# EasyEDA Pro project LEAP_ROS.epro, board PCB1
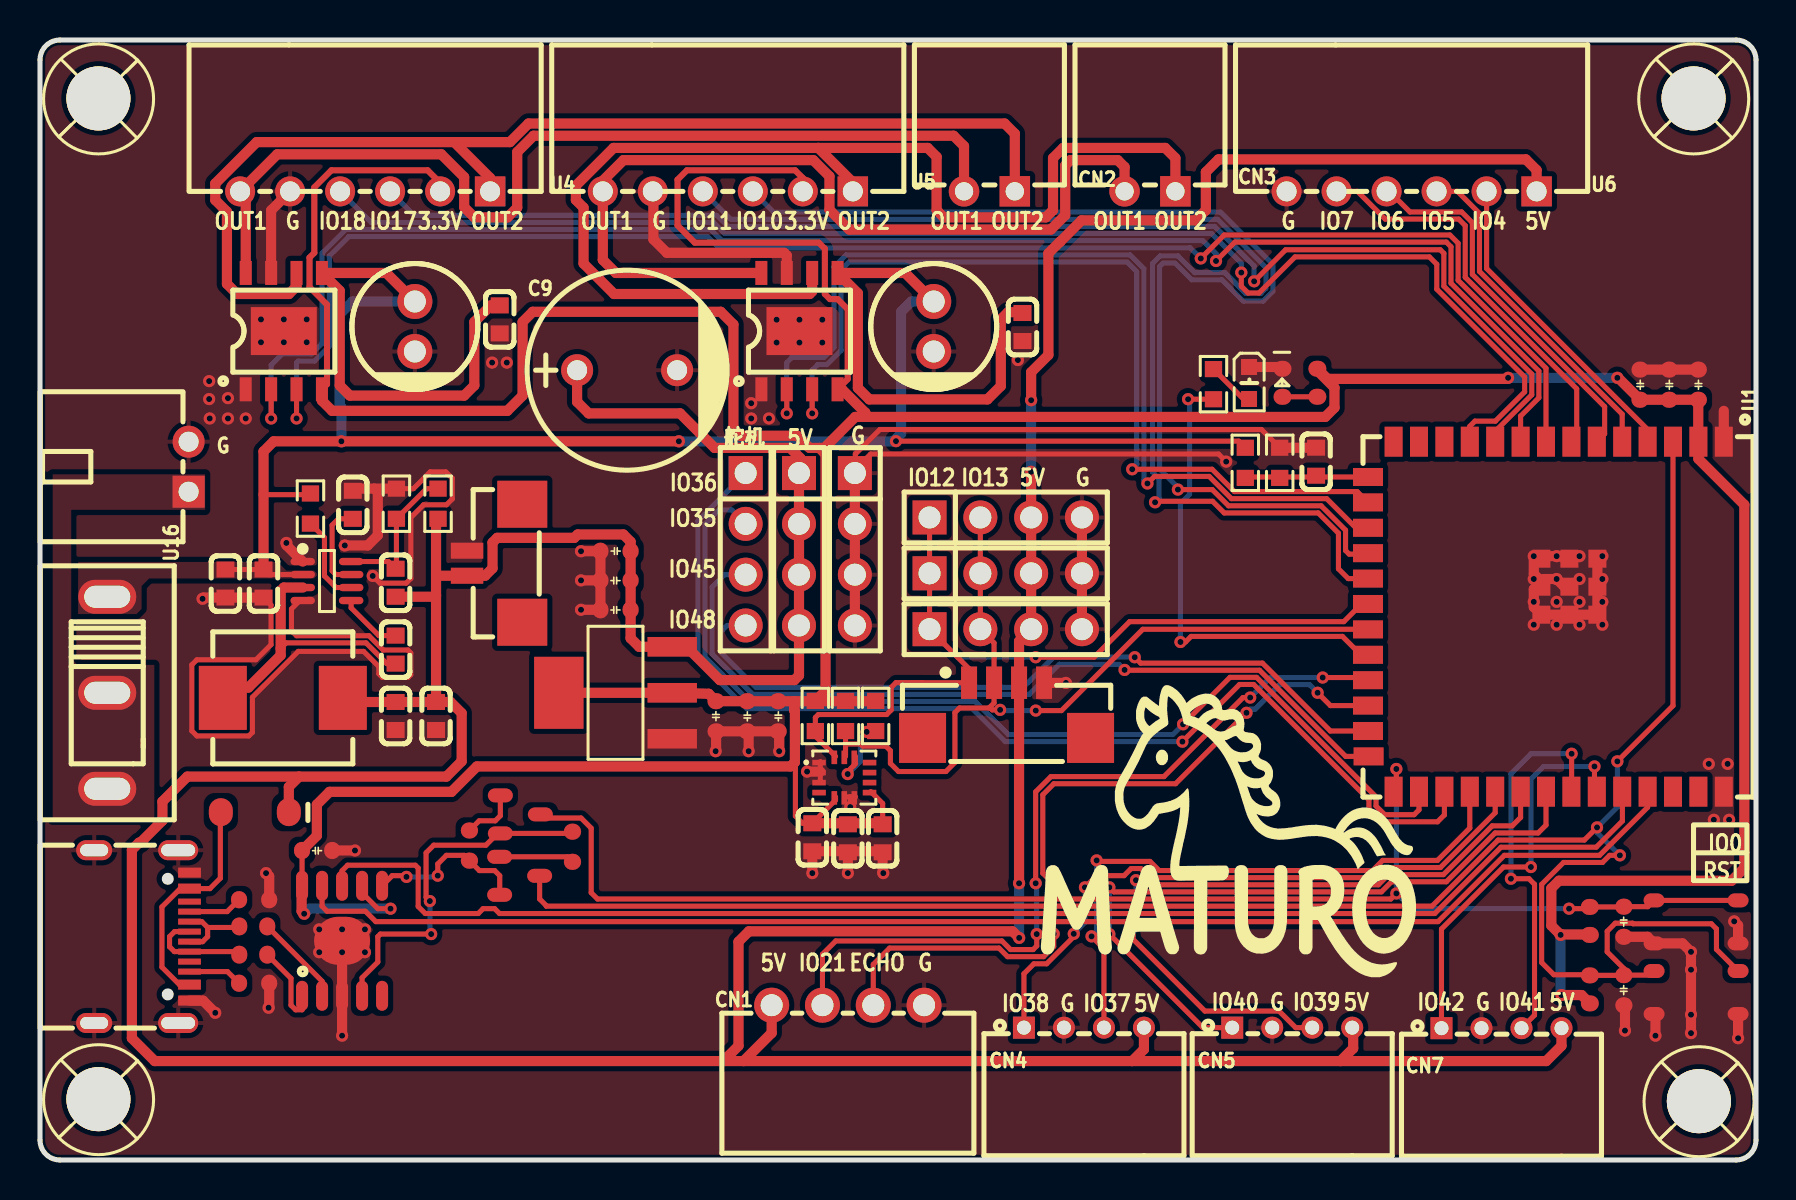
[diagram p2: board, top side]
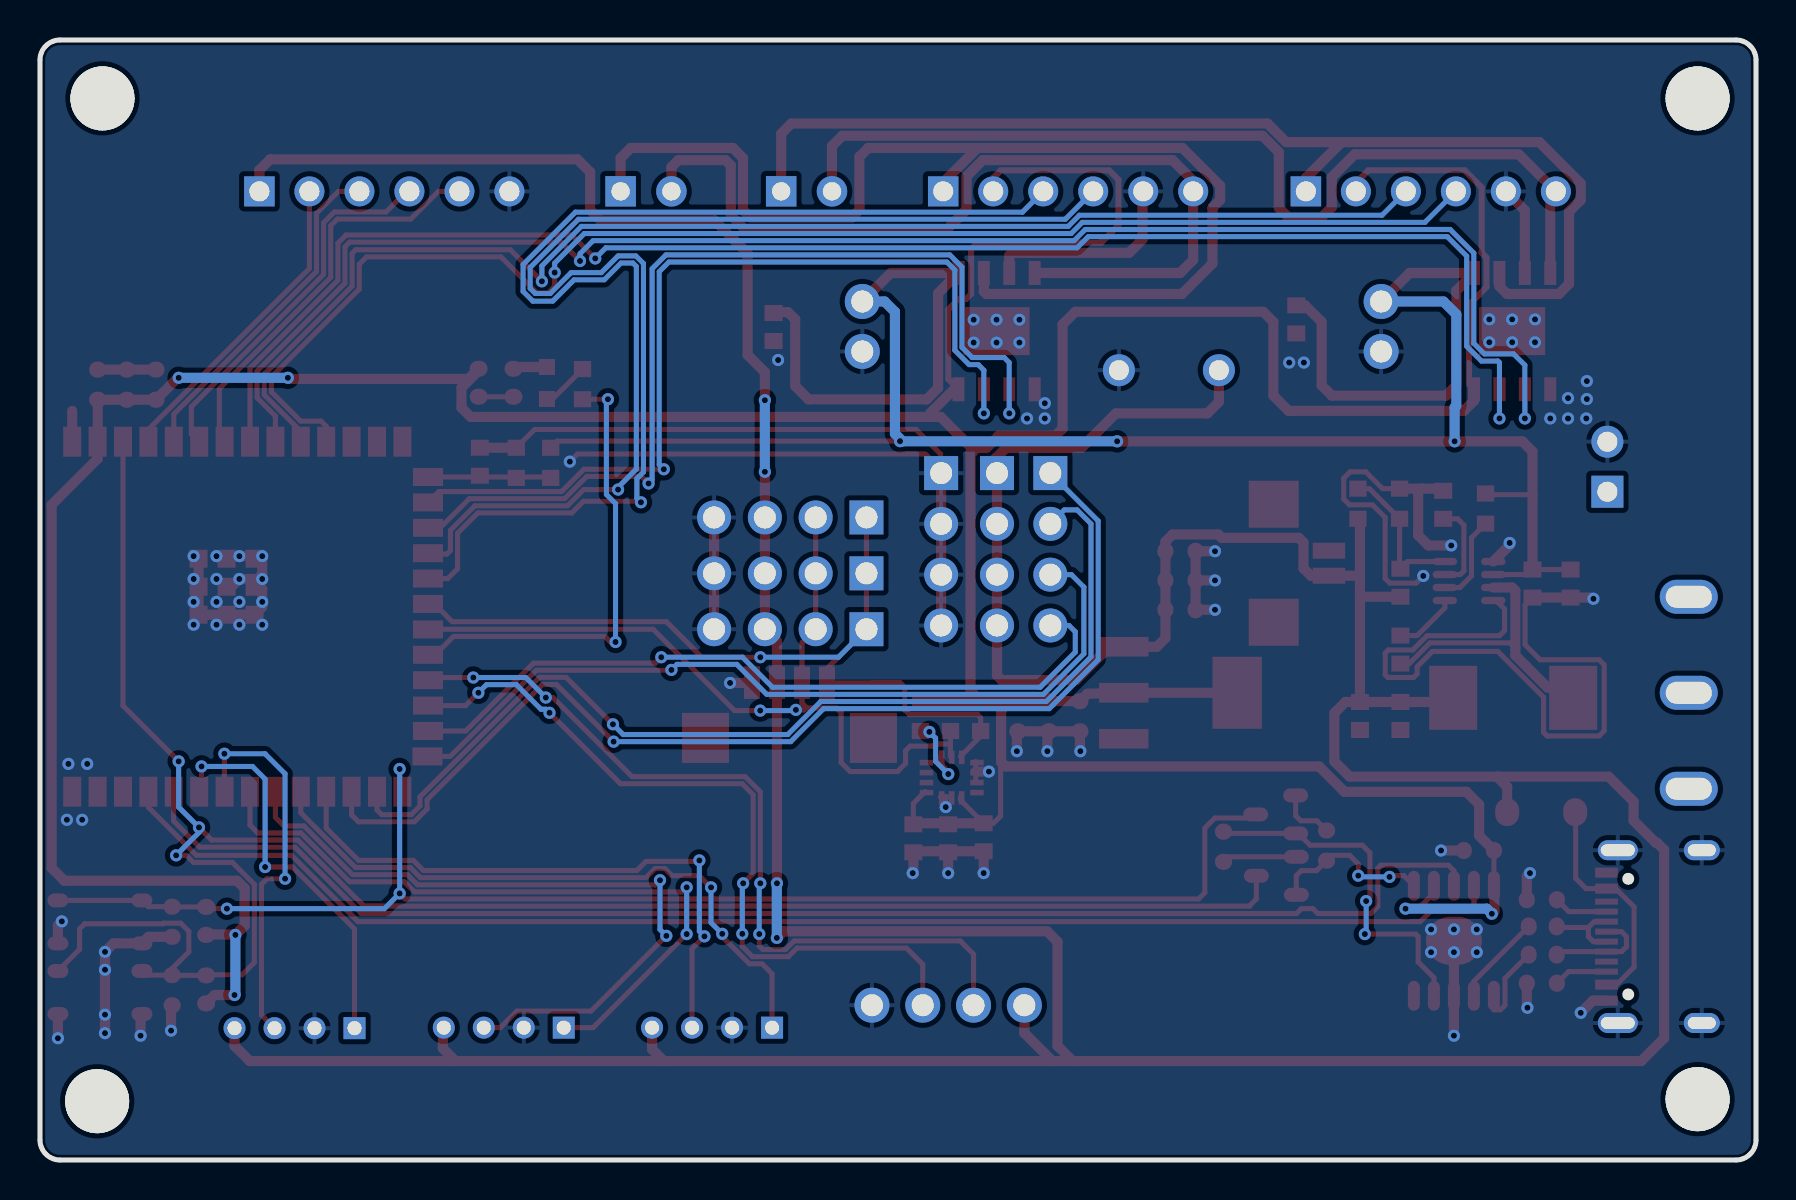
[diagram p3: board, bottom side, seen from below]

Outline 85.8 x 56 mm; copper layers: Top Layer, Bottom Layer. Coordinates in mm from the lower left corner of the outline.
Outline path: 0,55 0,1 arc(0.29,0.29) 1,0 84.8,0 arc(85.51,0.29) 85.8,1 85.8,55 arc(85.51,55.71) 84.8,56 1,56 arc(0.29,55.71) 0,55
Stack: Top Layer 0.035mm / Dielectric1 1.51mm FR4 er 4.5 / Bottom Layer 0.035mm

## Design rules (mm)
net GPIORX0: DP2
net GPIOTX0: DP2
net GPIO2: DP3
net GPIO1: DP3
net $2N57: DP1
net $2N56: DP1
spacing copperThickness1oz (default): track to track 0.102, other pairs 0.152 to 0.3
spacing copperThickness2oz: track to track 0.203, other pairs 0.152 to 0.3
spacing safeClearance1: track to track 0.152, other pairs 0 to 0.3
track width copperThickness1oz (default): min 0.127, default 0.254, max 2.54
track width copperThickness2oz: min 0.203, default 0.254, max 2.54
track width POWER: min 0.127, default 0.508, max 2.54
differential pair differentialPair (default): width min 0.127, default 0.254, max 2.54; gap min 0.152, default 0.152
net GND uses POWER, copperRegion
net 3V3 uses POWER
net 5V uses POWER

## Placement (name value [footprint] x y rotation side)
C1  100nF  [C0603#2]  38.62 16.14 90 top
C2  100nF  [C0603#2]  40.39 16.09 90 top
C3  10uF  [C0603#2]  42.13 16.09 90 top
C4  100nF  [C0603#2]  49.12 41.65 90 top
C5  220uF  [CAP-TH_BD6.3-P2.50-D0.6-FD-1]  18.74 41.67 270 top
C6  100nF  [C0603#2]  63.81 34.91 270 top
C7  220uF  [CAP-TH_BD6.3-P2.50-D0.6-FD-1]  44.69 41.67 270 top
C8  100nF  [C0603#2]  22.99 42.03 90 top
C9  2200uF  [CAP-TH_BD10.0-P5.00-D0.6-FD]  29.36 39.49 0 top
C14  10uF  [C0603#3]  36.92 22.18 90 top
C15  10uF  [C0603#3]  35.37 22.18 90 top
C16  100nF  [C0603]  33.8 22.2 90 top
C18  100nF  [C0603#2]  15.64 32.76 90 top
C19  22uF  [C0603#2]  11.18 28.82 90 top
C20  0.1uF  [C0603#2]  9.27 28.82 90 top
C21  33pF  [C0603#2]  17.78 28.86 270 top
C22  22uF  [C0603#2]  19.8 22.2 90 top
C23  22uF  [C0603#2]  17.78 22.2 90 top
C24  100nF  [C0603#2]  17.78 25.52 270 top
C25  10uF  [C0603#3]  28.77 28.96 0 top
C26  100nF  [C0603]  28.79 30.44 0 top
C27  100nF  [C0603#3]  79.18 11.92 270 top
C38  100nF  [C0603#3]  79.18 8.5 270 top
C41  100nF  [C0603]  80.01 38.75 270 top
C42  1uF  [C0603#4]  81.45 38.72 270 top
C43  10uF  [C0603]  82.93 38.75 270 top
C47  10uF  [C0603#3]  28.77 27.5 0 top
C144  100nF  [C0603]  13.84 15.47 180 top
CN1  XH-4AW  [CONN-TH_XH-4AW]  40.39 7.74 0 top
CN2  WAFER-XH254WZ-2AM  [CONN-TH_2P-P2.50_WAFER-XH254WZ-2A]  47.47 48.43 180 top
CN3  WAFER-XH254WZ-2AM  [CONN-TH_2P-P2.50_WAFER-XH254WZ-2A]  55.5 48.43 180 top
CN4  HC-PH2.0-4AW-M  [CONN-TH_HC-PH2.0-4AW-M]  52.2 6.62 0 top
CN5  HC-PH2.0-4AW-M  [CONN-TH_HC-PH2.0-4AW-M]  62.61 6.62 0 top
CN6  PH1250-LT-04  [CONN-SMD_PH1250-LT-04]  48.33 22.48 0 top
CN7  HC-PH2.0-4AW-M  [CONN-TH_HC-PH2.0-4AW-M]  73.07 6.59 0 top
CN8  PH1250-LT-02  [CONN-SMD_2P-P1.25_PH1250-LT-02]  22.73 29.84 90 top
D2  DSK310  [SOD-123FL_L2.8-W1.9-LS3.7-RD]  10.74 17.39 180 top
H1  PZ254V-11-04P  [HDR-TH_4P-P2.54-V-M]  48.29 32.13 0 top
H2  PZ254V-11-04P  [HDR-TH_4P-P2.54-V-M]  48.29 29.33 0 top
H3  PZ254V-11-04P  [HDR-TH_4P-P2.54-V-M]  35.28 30.54 270 top
H4  PZ254V-11-04P  [HDR-TH_4P-P2.54-V-M]  37.95 30.54 270 top
H5  PZ254V-11-04P  [HDR-TH_4P-P2.54-V-M]  48.29 26.54 0 top
H6  PZ254V-11-04P  [HDR-TH_4P-P2.54-V-M]  40.74 30.54 270 top
L1  4.7uH  [IND-SMD_L7.0-W6.6]  12.14 23.11 0 top
LED1  KT-0603W  [LED0603-R-RD_WHITE]  60.45 38.85 270 top
LED5  XL-1608SURC-06  [LED0603-RD_RED]  62.1 38.84 270 top
Q4  SS8050  [SOT-23-3_L2.9-W1.3-P1.90-LS2.4-BR]  23.98 14.21 180 top
Q5  SS8050  [SOT-23-3_L2.9-W1.3-P1.90-LS2.4-BR]  24.02 17.28 180 top
R1  5.1k  [R0603#3]  58.67 38.79 90 top
R2  10k  [R0603#3]  38.77 22.2 90 top
R3  10k  [R0603#3]  40.28 22.2 90 top
R4  10k  [R0603#3]  41.78 22.2 90 top
R5  100kΩ  [R0603#3]  60.27 34.86 90 top
R6  47kΩ  [R0603#3]  61.99 34.86 270 top
R7  100kΩ  [R0603#3]  13.52 32.57 90 top
R8  10kΩ  [R0603#2]  77.47 8.52 270 top
R9  40.2kΩ  [R0603#3]  19.9 32.81 270 top
R10  5.49kΩ  [R0603#3]  17.82 32.81 270 top
R16  4.7kΩ  [R0603]  21.47 15.73 90 top
R17  4.7kΩ  [R0603]  26.62 15.66 270 top
R23  5.1kΩ  [R0603#2]  63.88 38.86 90 top
R27  10kΩ  [R0603#2]  77.47 11.94 270 top
R34  5.1kΩ  [R0603]  10.68 13.01 180 top
R35  5.1kΩ  [R0603]  10.68 8.83 180 top
R36  22Ω  [R0603#2]  10.67 10.27 0 top
R37  22Ω  [R0603#2]  10.67 11.68 0 top
SCREW1  -  [M2螺丝]  82.68 53.08 0 top
SCREW2  -  [M2螺丝]  2.92 53.08 0 top
SCREW3  -  [M2螺丝]  2.92 3.04 0 top
SCREW4  -  [M2螺丝]  82.94 2.94 0 top
SW1  TSA016A2518A  [KEY-SMD_4P-L4.2-W3.4-P2.15-LS4.5-TL]  82.8 11.91 0 top
SW2  TSA016A2518A  [KEY-SMD_4P-L4.2-W3.4-P2.15-LS4.5-TL]  82.8 8.38 0 top
U1  2.4GHz  [WIRELM-SMD_ESP32-S3-WROOM-1U]  75.29 27.17 270 top
U2  LSM6DS3TR-C  [LGA-14_L3.0-W2.5-P0.50-TL]  40.22 19.12 0 top
U3  AT8236  [ESOP-8_L4.9-W3.9-P1.27-LS6.0-BL-EP]  12.19 41.44 0 top
U4  ZX-XH2.54-6PWZ  [CONN-TH_6P-P2.50_ZX-XH2.54-6PWZ]  16.26 48.43 180 top
U5  ZX-XH2.54-6PWZ  [CONN-TH_6P-P2.50_ZX-XH2.54-6PWZ]  34.39 48.43 180 top
U6  ZX-XH2.54-6PWZ  [CONN-TH_6P-P2.50_ZX-XH2.54-6PWZ]  68.58 48.43 180 top
U7  AT8236  [ESOP-8_L4.9-W3.9-P1.27-LS6.0-BL-EP]  37.97 41.44 0 top
U13  MP2225GJ-Z  [TSOT-23-8_L2.9-W1.6-P0.65-LS2.8-BR]  14.35 28.95 180 top
U14  AMS1117-3.3V  [SOT-223-4_L6.5-W3.5-P2.30-LS7.0-TR]  28.78 23.36 90 top
U15  USB-TYPE-C-019  [TYPE-C-SMD_HX-TYPE-C-16PIN]  5.09 11.17 270 top
U16  SS12D10G5  [SW-TH_SHOU-HAN_SS12D10G4]  3.36 23.36 270 top
U26  CH340K  [ESOP-10_L4.9-W3.9-P1.00-LS6.2-BL-EP]  15.1 10.96 0 top
U30  KH-A2504-02AW  [CONN-TH_2P-P2.50_KH-A2504-02AW]  7.43 34.66 270 top

## Footprints (pads in the part's own frame, mm; a bottom-side part is the same pattern mirrored in y, then rotated)
C0603
  rrect 0.806x0.864 smd: 1(-0.766,-0.006) 2(0.74,-0.006)
C0603#4
  rrect 0.806x0.864 smd: 1(-0.796,0.011) 2(0.71,0.011)
C0603#2
  rect 0.8x0.9 smd: 1(-0.7,0) 2(0.7,0)
C0603#3
  rrect 0.806x0.864 smd: 1(0.766,0.014) 2(-0.741,0.014)
CAP-TH_BD6.3-P2.50-D0.6-FD-1
  round 1.75 hole 1.1: 1(-1.25,0) 2(1.25,0)
CAP-TH_BD10.0-P5.00-D0.6-FD
  round 1.6 hole 1: 1(-2.5,0) 2(2.5,0)
CONN-SMD_2P-P1.25_PH1250-LT-02
  rect 0.8x1.62 smd: 1(-0.625,1.38) 2(0.625,1.38)
  rect 2.35x2.5 smd: 3(-2.95,-1.38) 4(2.95,-1.38)
CONN-SMD_PH1250-LT-04
  rect 0.8x1.62 smd: 1(-1.875,1.38) 2(-0.625,1.38) 3(0.625,1.38) 4(1.875,1.38)
  rect 2.35x2.5 smd: 5(4.2,-1.38) 6(-4.2,-1.38)
CONN-TH_2P-P2.50_KH-A2504-02AW
  rect 1.6x1.6 hole 1: 1(1.25,0)
  round 1.6 hole 1: 2(-1.25,0)
CONN-TH_2P-P2.50_WAFER-XH254WZ-2A
  rect 1.524x1.524 hole 0.914: 1(-1.27,0)
  round 1.524 hole 0.914: 2(1.27,0)
CONN-TH_6P-P2.50_ZX-XH2.54-6PWZ
  rect 1.524x1.5 hole 1: 1(-6.25,0)
  round 1.5 hole 1: 2(-3.75,0) 3(-1.25,0) 4(1.25,0) 5(3.75,0) 6(6.25,0)
CONN-TH_HC-PH2.0-4AW-M
  rect 1.1x1.1 hole 0.7: 1(-3,0)
  round 1.1 hole 0.7: 2(-1,0) 3(1,0) 4(3,0)
CONN-TH_XH-4AW
  round 1.75 hole 1.1: 1(-3.81,0) 2(-1.27,0) 3(1.27,0) 4(3.81,0)
ESOP-8_L4.9-W3.9-P1.27-LS6.0-BL-EP
  rect 0.6x1.2 smd: 1(-1.905,-2.909) 2(-0.635,-2.909) 3(0.635,-2.909) 4(1.905,-2.909) 5(1.905,2.909) 6(0.635,2.909) 7(-0.635,2.909) 8(-1.905,2.909)
  rect 3.3x2.4 smd: 9(0,0)
ESOP-10_L4.9-W3.9-P1.00-LS6.2-BL-EP
  rrect 0.6x1.5 smd: 1(-2,-2.75) 2(-1,-2.75) 3(0,-2.75) 4(1,-2.75) 5(2,-2.75) 6(2,2.75) 7(1,2.75) 8(0,2.75) 9(-1,2.75) 10(-2,2.75)
  rrect 2.8x2.4 smd: 11(0,0)
HDR-TH_4P-P2.54-V-M
  rect 1.7x1.7 hole 1.1: 1(-3.81,0)
  round 1.7 hole 1.1: 2(-1.27,0) 3(1.27,0) 4(3.81,0)
IND-SMD_L7.0-W6.6
  rect 2.4x3.2 smd: 1(-3,0) 2(3,0)
KEY-SMD_4P-L4.2-W3.4-P2.15-LS4.5-TL
  rrect 1.05x0.7 smd: 1(-2.1,1.075) 1(2.1,1.075) 2(-2.1,-1.075) 2(2.1,-1.075)
LED0603-R-RD_WHITE
  rect 0.8x0.8 smd: 1(0.8,0) 2(-0.8,0)
LED0603-RD_RED
  rrect 0.8x0.9 smd: 1(-0.726,0.022) 2(0.675,0.022)
LGA-14_L3.0-W2.5-P0.50-TL
  rect 0.675x0.28 smd: 1(-1.262,0.75) 2(-1.262,0.25) 3(-1.262,-0.25) 4(-1.262,-0.75) 8(1.262,-0.75) 9(1.262,-0.25) 10(1.262,0.25) 11(1.262,0.75)
  rect 0.28x0.675 smd: 5(-0.5,-1.012) 6(0,-1.012) 7(0.5,-1.012) 12(0.5,1.012) 13(0,1.012) 14(-0.5,1.012)
M2螺丝
  round 3.2 hole 3.2: 1(0,0)
R0603
  rrect 0.806x0.864 smd: 1(-0.784,-0.005) 2(0.723,-0.005)
R0603#2
  rrect 0.8x0.9 smd: 1(-0.715,0.022) 2(0.685,0.022)
R0603#3
  rect 0.806x0.864 smd: 1(-0.753,0) 2(0.753,0)
SOD-123FL_L2.8-W1.9-LS3.7-RD
  rrect 1.2x1.4 smd: 1(-1.7,0) 2(1.7,0)
SOT-23-3_L2.9-W1.3-P1.90-LS2.4-BR
  rrect 1.25x0.7 smd: 1(1,-0.95) 2(1,0.95) 3(-1,0)
SOT-223-4_L6.5-W3.5-P2.30-LS7.0-TR
  rect 0.98x2.47 smd: 1(-2.3,-2.835) 2(0,-2.835) 3(2.3,-2.835)
  rect 3.6x2.47 smd: 4(0,2.835)
SW-TH_SHOU-HAN_SS12D10G4
  oval 1.7x2.9 hole 1.1x2.3: 1(-4.8,0) 2(0,0) 3(4.8,0)
TSOT-23-8_L2.9-W1.6-P0.65-LS2.8-BR
  oval 1.222x0.364 smd: 1(1.211,-0.975) 2(1.211,-0.325) 3(1.211,0.325) 4(1.211,0.975) 5(-1.211,0.975) 6(-1.211,0.325) 7(-1.211,-0.325) 8(-1.211,-0.975)
TYPE-C-SMD_HX-TYPE-C-16PIN
  oval 1x2 hole 0.6x1.7: 1(-4.32,1.816) 1(4.32,1.816)
  oval 1x1.8 hole 0.6x1.4: 1(-4.32,-2.384) 1(4.32,-2.384)
  rect 0.5x1.14 smd: A1(-3.2,2.384) A4(-2.4,2.384) A9(2.4,2.384) A12(3.2,2.384)
  rect 0.3x1.14 smd: A5(-1.25,2.383) A6(-0.25,2.383) A7(0.25,2.383) A8(1.25,2.384) B5(1.75,2.383) B6(0.75,2.383) B7(-0.75,2.383) B8(-1.75,2.384)
WIRELM-SMD_ESP32-S3-WROOM-1U
  rect 1.5x0.9 smd: 1(-8.75,8.895) 2(-8.75,7.625) 3(-8.75,6.355) 4(-8.75,5.085) 5(-8.75,3.815) 6(-8.75,2.545) 7(-8.75,1.275) 8(-8.75,0.005) 9(-8.75,-1.265) 10(-8.75,-2.535) 11(-8.75,-3.805) 12(-8.75,-5.075) 13(-8.75,-6.345) 14(-8.75,-7.615) 27(8.75,-7.615) 28(8.75,-6.345) 29(8.75,-5.075) 30(8.75,-3.805) 31(8.75,-2.535) 32(8.75,-1.265) 33(8.75,0.005) 34(8.75,1.275) 35(8.75,2.545) 36(8.75,3.815) 37(8.75,5.085) 38(8.75,6.355) 39(8.75,7.625) 40(8.75,8.895)
  rect 0.9x1.5 smd: 15(-6.985,-8.895) 16(-5.715,-8.895) 17(-4.445,-8.895) 18(-3.175,-8.895) 19(-1.905,-8.895) 20(-0.635,-8.895) 21(0.635,-8.895) 22(1.905,-8.895) 23(3.175,-8.895) 24(4.445,-8.895) 25(5.715,-8.895) 26(6.985,-8.865)
  rect 0.9x0.9 smd: 41(-2.9,2.575) 41(-2.9,1.175) 41(-2.9,-0.225) 41(-1.5,2.575) 41(-1.5,1.175) 41(-1.5,-0.225) 41(-0.1,2.575) 41(-0.1,1.175) 41(-0.1,-0.225)

## Nets
As in the schematic.

Pads without a net: CN6 5 6; CN8 3 4; SCREW1 1; SCREW2 1; SCREW3 1; SCREW4 1; U2 4 9 10 11; U15 A8 B8; U26 5

## Via types
v1: diameter 0.61, hole 0.305, Top Layer to Bottom Layer, 146 vias

## Routing (per net, layer and track width the routed paths; a pad name or vN(x,y) marks a point on that pad's centre or on a via; arc(x,y) is an arc through that point)
3V3: length 253.5
  Top Layer w0.254: U26.10 13.1,15.47 ; 37.7,22.94 37.85,22.79 37.85,22.65 37.7,22.5 ; 41.54,18.42 42.13,17.83 C3.2 ; v1(17.53,12.57) 16.89,12.57 16.1,13.35 U26.7 ; 39.78,18.16 39.78,18 C1.2 38.13,16.84 37.77,17.2 37.77,19.78 37.7,19.85
  Top Layer w0.305: U7.4 40.39,39.04 40.39,42.54 39.88,43.05 39.5,43.05 39.24,43.3 39.24,45.56 38.94,45.87 32.74,45.87 31.88,46.73 31.88,49.02 32.35,49.48 37.76,49.48 38.14,49.1 U5.2 ; U3.4 14.35,38.79 14.35,42.77 13.48,43.64 13.48,45.12 13.72,45.36 13.72,48.63 14.57,49.48 19.38,49.48 20.01,48.86 U4.2
  Top Layer w0.508: U3.4 14.1,37.97 14.61,37.46 23.37,37.46 24.13,38.22 24.13,41.9 24.64,42.41 34.04,42.41 34.67,41.78 34.67,36.57 35.03,36.21 37.87,36.21 38.48,35.6 38.97,35.6 ; 41.27,37.15 40.76,37.15 39.21,35.6 38.97,35.6 ; 41.27,37.15 41.27,37.36 40.1,38.54 U7.4 ; 41.27,37.15 64.26,37.15 64.72,37.62 64.72,38.61 63.87,39.47 R23.2 64.38,39.06 73.35,39.06 v1(73.41,39.11) ; v1(76.07,8.25) 77.08,8.25 R8.2 ; R27.2 77.47,11.28 76.05,11.28 v1(76.03,11.25) 75.56,11.72 75.56,13.58 75.95,13.96 84.58,13.96 85.22,14.6 85.22,32.76 82.92,35.06 U1.2 82.91,35.92 82.91,38.01 C42.2 C41.2 78.91,39.11 v1(78.87,39.11) ; 38.97,35.6 39.2,35.37 39.28,35.37 39.28,23.46 R2.2 ; U14.4 31.61,23.36 33.43,23.31 33.81,22.94 C15.1 C14.1 37.7,22.94 ; 37.7,22.94 37.7,22.5 37.75,22.46 37.75,19.89 37.53,19.68 21.84,19.68 20.57,18.41 14.48,18.41 13.84,17.77 13.84,16.22 C144.2 ; 37.7,22.94 41.77,22.94 R4.2 ; C3.2 42.08,16.84 C1.2 ; v1(13.21,12.31) 13.08,12.44 13.08,13.69 U26.10
  Bottom Layer w0.508: v1(76.07,8.25) 76.03,8.29 v1(76.03,11.25) ; v1(13.21,12.31) 13.46,12.57 v1(17.53,12.57) ; v1(78.87,39.11) v1(73.41,39.11)
5V: length 265.4
  Top Layer w0.508: 65.02,4.95 65.66,5.58 65.66,6.57 CN5.4 ; 65.02,4.95 54.61,4.95 ; 65.02,4.95 75.31,4.95 76.07,5.71 ; CN4.4 55.2,5.53 54.61,4.95 ; 34.16,4.95 5.74,4.95 4.59,6.09 4.59,15.51 4.95,15.87 5.02,15.87 6.12,16.97 6.12,17.92 7.37,19.17 12.95,19.17 ; 34.16,4.95 35.18,4.95 ; 34.16,4.95 34.93,5.71 34.93,10.92 35.45,11.44 48.63,11.44 v1(48.96,11.11) ; C22.2 19.8,28.22 ; C22.2 C23.2 15.35,22.9 L1.2 ; C22.2 20.53,22.9 21.08,22.34 21.08,19.93 20.32,19.17 12.95,19.17 ; 19.8,28.22 19.74,28.16 C21.2 ; 19.8,28.22 19.8,29.26 ; 19.8,29.26 19.8,31.96 19.9,32.06 ; 19.8,29.26 19.85,29.21 CN8.1 22.25,29.21 22.63,29.58 22.63,30.87 22.86,31.11 26.72,31.11 26.88,31.28 29.17,31.28 29.53,30.92 C26.2 ; 12.95,19.17 12.44,18.66 D2.1 ; 54.61,4.95 35.18,4.95 ; 35.18,4.95 36.58,6.35 CN1.1 ; U6.1 74.83,49.5 74.29,50.03 58.93,50.03 58.29,49.4 58.29,47.49 57.78,46.98 52.08,46.98 51.01,45.91 51,45.91 50.42,45.33 50.42,40.25 49.56,39.39 v1(49.56,37.99) ; 76.07,5.71 CN7.4 ; v1(49.56,34.41) 49.56,26.54 48.95,25.94 CN6.3 v1(48.95,13.84) ; 29.53,30.44 C25.1 C47.1 29.53,26.09 29.96,25.66 31.61,25.66 32.33,25.66 33.99,24 37.72,24 37.95,24.23 H4.4 H4.3 H4.2 H4.1 38.01,34.41 38.01,35.09 37.51,35.6 33.73,35.6 32,37.33 27.43,37.33 26.86,37.91 C9.1
  Bottom Layer w0.508: v1(49.56,34.41) v1(49.56,37.99) ; v1(48.95,13.84) 48.96,13.83 v1(48.96,11.11)
GND: length 192.3
  Top Layer w0.254: 40.28,18.16 40.5,18.16 ; 40.5,18.16 40.51,18.14 v1(40.51,17.65) ; 40.5,18.16 40.78,18.16 ; R6.1 61.07,36.53 41.99,36.53 40.77,35.3 40.77,34.53 ; U13.4 12.99,27.97 12.57,27.55 12.57,26.47 12.83,26.21 16.45,26.21 17.16,25.5 18.39,25.5 18.54,25.35 18.54,24.26 18.41,24.13 17.12,24.13 16.94,24.31 16.94,24.67 16.18,25.43 12.91,25.43 10.62,23.14 10.62,21.38 10.44,21.2 7.84,21.2 7.59,21.46 7.59,24.76 7.84,25.01 10.8,25.01 11.55,25.77 11.55,27.75 C19.1 ; 40.77,34.53 41.53,35.3 58.93,35.3 v1(59.31,34.92) ; 40.77,34.53 40.74,34.51 H6.1 ; 39.01,18.92 39.01,19.92 ; v1(16.64,29.2) 17,28.84 18.31,28.84 18.54,29.08 18.54,32.12 19.18,32.76 20.32,32.76 20.61,33.05 20.61,34.09 20.29,34.41 19.51,34.41 18.67,33.57 R10.1
  Top Layer w0.508: U4.5 11.56,47.48 U3.7 ; SW2.2 80.77,7.23 v1(80.77,6.22) ; C144.1 v1(15.75,15.48) ; v1(11.3,14.34) 11.46,14.19 11.46,13.02 ; 75.07,28.92 74.69,28.54 v1(74.69,27.91) 74.69,27.65 U1.41 U1.41 U1.41 U1.41 U1.41 ; 75.07,28.92 74.69,29.3 v1(74.69,30.19) 76.09,30.19 76.21,30.07 ; 75.07,28.92 75.2,29.05 v1(75.83,29.05) 76.22,28.67 U1.41 ; U7.7 37.34,45.23 37.21,45.36 31.34,45.36 30.67,46.03 30.67,48.4 U5.5 ; 28.02,28.98 v1(27.05,28.98) ; 28.02,28.98 28.02,27.51 v1(27.05,27.51) ; 28.02,28.98 C26.1 v1(27.05,30.44) ; v1(42.16,14.34) 42.13,14.38 C3.1 42.08,15.44 C1.1 v1(38.62,14.34) ; C27.1 80.38,11.16 SW1.2 82.13,10.83 v1(82.55,10.41) v1(82.55,9.51) v1(82.55,7.27) v1(82.55,6.34) ; H1.4 H2.4 H5.4 ; v1(79.25,6.47) 79.25,7.68 C38.1 ; U26.11 v1(15.1,10.39) v1(15.1,6.22) ; v1(84.71,11.93) 84.9,11.74 SW1.2 ; C15.2 33.81,21.43 33.81,20.46 v1(33.78,20.44) ; C15.2 C14.2 36.96,21.38 v1(36.96,20.44) ; C15.2 35.43,21.36 v1(35.43,20.44) ; CN6.4 50.21,23.85 v1(51.3,23.85) ; LED1.2 62.04,39.65 LED5.1 ; R10.1 16.72,33.57 ; 16.72,33.57 16.89,33.4 16.89,31.23 16.38,30.73 v1(15.24,30.73) ; 16.72,33.57 15.75,33.57 C18.2 ; C2.1 v1(40.39,14.34) ; 39.01,19.42 v1(38.35,19.42) ; H6.1 H6.2 H6.3 H6.4 ; v1(12.32,30.85) 12.32,30.74 U13.1 ; U15.A12 8.15,7.97 v1(8.76,7.36) ; C41.1 C42.1 C43.1 ; C19.1 C20.1 8.19,28.12 v1(8.13,28.06) ; SW2.2 v1(84.9,6.09) ; R6.1 63.8,35.61 C6.1 ; v1(11.43,7.61) 11.46,7.64 R35.1 ; U1.1 84.19,37.46
  vias: v1(8.46,38.94) v1(8.46,38.05) v1(8.49,37.08) v1(9.4,38.09) v1(9.4,37.08) v1(10.29,37.08) v1(11.05,42.03) v1(11.05,40.89) v1(12.19,42.03) v1(12.19,40.89) v1(13.33,42.03) v1(13.33,40.89) v1(13.96,11.53) v1(13.96,10.39) v1(15.1,11.53) v1(16.25,11.53) v1(16.25,10.39) v1(22.61,39.87) v1(23.34,39.87) v1(35.56,37.84) v1(35.56,37.08) v1(36.45,37.08) v1(36.83,42.02) v1(36.83,40.87) v1(37.97,42.02) v1(37.97,40.87) v1(39.12,42.02) v1(39.12,40.87) v1(48.9,40) v1(74.69,29.05) v1(74.69,26.76) v1(75.83,30.19) v1(75.83,27.91) v1(75.83,26.76) v1(76.97,30.19) v1(76.97,29.05) v1(76.97,27.91) v1(76.97,26.76) v1(78.12,30.19) v1(78.12,29.05) v1(78.12,27.91) v1(78.12,26.76) v1(83.44,19.81) v1(83.69,17.01) v1(84.38,19.81) v1(84.46,17.01)
VBUS: length 11.6
  Top Layer w0.254: U15.A9 6.97,8.77 6.1,9.64 6.1,12.65 7.01,13.57 U15.A4 8.5,13.57 9.02,14.09 9.02,17.37 9.04,17.39
ADC1: length 6.2
  Top Layer w0.254: U1.15 60.31,34.15 60.27,34.11
DTR: length 17.9
  Top Layer w0.254: R17.1 26.54,16.33 Q5.2 22.89,16.33 22.3,15.74 19.69,15.74 19.3,15.36 19.3,13.14 v1(19.49,12.95) ; v1(19.56,11.3) 17.02,11.3 16.89,11.17 16.89,9.9 16.1,9.11 16.1,8.21
  Bottom Layer w0.254: v1(19.56,11.3) 19.49,11.36 v1(19.49,12.95)
ECHO: length 38.6
  Top Layer w0.254: v1(50.69,11.31) 50.69,10.67 50.18,10.17 48.38,10.17 47.95,10.6 42.48,10.6 41.66,9.78 CN1.3 ; U1.24 64.52,22.72 v1(63.88,23.36) ; v1(50.64,13.84) 50.14,14.34 50.14,18.26 50.69,18.81 56.78,18.81 v1(60.32,22.36)
  Bottom Layer w0.254: v1(50.69,11.31) 50.69,13.79 v1(50.64,13.84) ; v1(63.88,23.36) 63.47,23.77 61.98,23.77 60.75,22.54 60.5,22.54 v1(60.32,22.36)
GPIO0: length 71.5
  Top Layer w0.254: v1(76.45,12.57) 77.4,12.57 R27.1 79.18,12.65 C27.2 80.39,12.67 80.7,12.98 84.9,12.98 ; v1(67.82,13.33) 67.54,13.05 27.88,13.05 27.56,13.37 27.56,16.59 27.05,17.1 25.2,17.1 Q5.3 ; v1(67.82,19.55) 67.82,18.55 U1.27
  Bottom Layer w0.254: v1(76.45,12.57) 68.58,12.57 v1(67.82,13.33) v1(67.82,19.55)
GPIO4: length 15.8
  Top Layer w0.254: U6.2 72.33,44.58 80.38,36.53 U1.4
GPIO5: length 17
  Top Layer w0.254: U6.3 70.88,48.43 71.97,47.33 71.97,44.43 79.11,37.29 U1.5
GPIO6: length 18.8
  Top Layer w0.254: U6.4 67.47,48.43 68.5,47.4 71.08,47.4 71.62,46.87 71.62,44.28 78.23,37.67 78.23,36.31 U1.6
GPIO7: length 20.4
  Top Layer w0.254: U6.5 65.88,48.43 67.26,47.05 70.93,47.05 71.26,46.72 71.26,44.13 76.84,38.56 76.84,36.18 U1.7
GPIO9: length 49.5
  Top Layer w0.254: U1.17 65.79,31.61 64.34,33.07 59.57,33.07 58.46,34.18 55.73,34.18 v1(55.37,33.83) ; v1(37.34,37.33) U7.2
  Bottom Layer w0.254: v1(55.37,33.83) 55.19,34 55.19,44.56 54.5,45.25 40.31,45.25 39.7,44.65 39.7,40.63 39.19,40.12 37.59,40.12 37.34,39.87 v1(37.34,37.33)
GPIO10: length 58.6
  Top Layer w0.254: v1(56.9,33.52) 58.61,33.52 59.42,32.71 64.06,32.71 65.28,31.49 65.28,30.47 65.46,30.29 66.35,30.29 U1.18
  Bottom Layer w0.254: U5.3 36.68,47.39 59.03,47.39 61.65,44.77 61.65,43.43 61.16,42.94 60.16,42.94 59.1,44.01 57.59,44.01 56.75,44.85 56.15,44.85 55.98,44.68 55.98,34.55 56.9,33.63 v1(56.9,33.52)
GPIO11: length 63
  Top Layer w0.254: U1.19 65.41,29.07 64.92,29.56 64.92,31.34 63.91,32.35 59.21,32.35 58.63,32.94 55.8,32.94 v1(55.75,32.89)
  Bottom Layer w0.254: U5.4 34.53,47.04 58.88,47.04 61.29,44.63 61.29,43.58 61.04,43.33 60.29,43.33 59.25,44.37 57.73,44.37 56.9,45.2 56.01,45.2 55.63,44.82 55.63,34.4 55.96,34.07 55.96,33.09 v1(55.75,32.89)
GPIO12: length 44.2
  Top Layer w0.254: U1.20 66.27,27.93 66.21,27.93 65.19,26.92 54.48,26.92 52.71,25.14 v1(49.78,25.14) ; 39.78,20.18 38.77,21.19 R2.1 38.77,22.12 38.92,22.27 42.33,22.27 42.56,22.5 42.56,23.63 42.8,23.87 44.12,23.87 44.13,23.86 CN6.1 46.45,24.56 H5.1 H2.1 H1.1
  Bottom Layer w0.254: v1(49.78,25.14) 45.88,25.14 H5.1
GPIO13: length 42.8
  Top Layer w0.254: U1.21 66.4,26.54 55.14,26.54 51.07,22.47 v1(49.79,22.47) ; 47.49,22.63 47.7,22.85 CN6.2 47.7,25.85 H5.2 H2.2 H1.2 ; 47.49,22.63 47.45,22.6 45.97,22.6 45.75,22.37 45.75,19.88 45.29,19.42 42.93,19.42 42.52,19.83 42.52,20.46 42.29,20.69 41.14,20.69 41.03,20.8 40.31,20.8 40.28,20.83 ; 47.49,22.63 47.61,22.51 v1(48.01,22.51) ; 40.28,20.83 40.28,21.45 ; 40.28,20.83 40.28,20.18
  Bottom Layer w0.254: v1(48.01,22.51) 48.04,22.47 v1(49.79,22.47)
GPIO14: length 23.5
  Top Layer w0.254: 58.67,38.04 v1(57.4,38.04) ; v1(57.02,25.9) 57.28,25.9 57.56,26.18 65.12,26.18 66.04,25.26 U1.22
  Bottom Layer w0.254: v1(57.4,38.04) 57.48,37.96 57.48,33.28 57.02,32.82 v1(57.02,25.9)
GPIO15: length 80.4
  Top Layer w0.254: U1.8 75.3,39.59 70.91,43.98 70.91,45.84 70.5,46.25 59.21,46.25 v1(58.04,45.08) ; U3.3 v1(12.83,37.08)
  Bottom Layer w0.254: v1(12.83,37.08) 12.83,39.87 12.9,39.95 13.72,39.95 14.46,40.69 14.46,45.2 15.44,46.17 33.39,46.17 33.95,45.61 57.51,45.61 v1(58.04,45.08)
GPIO16: length 81.9
  Top Layer w0.254: v1(58.8,44.95) 59.75,45.89 70.32,45.89 70.55,45.66 70.55,43.84 74.94,39.44 74.94,38.11 74.03,37.2 U1.9 ; U3.2 v1(11.56,37.08)
  Bottom Layer w0.254: v1(58.8,44.95) 58.8,45.31 58.14,45.97 34.09,45.97 33.54,46.53 15.29,46.53 14.11,45.34 14.11,40.83 13.58,40.3 12.12,40.3 11.56,39.74 v1(11.56,37.08)
GPIO17: length 67.7
  Top Layer w0.254: U1.10 72.76,36.43 74.59,38.26 74.59,39.3 70.19,43.69 70.19,45.33 70.01,45.51 62.28,45.51 v1(60.71,43.94)
  Bottom Layer w0.254: U4.3 18.7,47.24 33.83,47.24 34.39,46.68 58.73,46.68 60.71,44.71 v1(60.71,43.94)
GPIO18: length 70.9
  Top Layer w0.254: v1(60.07,44.37) 60.07,43.69 60.4,43.35 60.95,43.35 62.75,45.16 69.47,45.16 69.84,44.79 69.84,43.54 74.23,39.15 74.23,38.41 72.77,36.94 71.75,36.94 71.49,36.69 U1.11
  Bottom Layer w0.254: v1(60.07,44.37) 60.07,44.84 58.58,46.32 34.24,46.32 33.68,46.88 16.56,46.88 U4.4
GPIO21: length 40.4
  Top Layer w0.254: v1(49.78,13.84) 49.78,18.41 50.55,19.17 56.2,19.17 60.15,23.12 v1(60.51,23.12) ; v1(49.84,11.3) 49.84,10.7 49.66,10.52 48.53,10.52 48.1,10.95 39.79,10.95 39.12,10.29 CN1.2 ; U1.23 66.27,24.12 v1(64.13,24.12)
  Bottom Layer w0.254: v1(60.51,23.12) 61.51,24.12 v1(64.13,24.12) ; v1(49.84,11.3) 49.84,13.71
GPIO35: length 51.9
  Top Layer w0.254: U1.28 68.95,17.51 68.71,17.27 67.24,17.27 66.8,17.7 66.8,18.16 60.83,24.13 59.5,24.13 v1(57.15,21.79)
  Bottom Layer w0.254: v1(57.15,21.79) 56.64,21.27 48.41,21.27 46.76,22.92 35.48,22.92 33.25,25.16 33.25,31.81 33.94,32.5 34.58,32.5 H3.2
GPIO36: length 54.9
  Top Layer w0.254: v1(57.12,20.92) 59.98,23.78 60.68,23.78 66.45,18.01 66.45,17.55 67.09,16.91 69.88,16.91 70.22,17.25 U1.29
  Bottom Layer w0.254: H3.1 32.89,31.96 32.89,25.01 35.34,22.57 46.61,22.57 48.27,20.92 v1(57.12,20.92)
GPIO37: length 30.3
  Top Layer w0.254: U1.30 71.49,16.6 69.87,14.98 67.13,14.98 66.63,14.47 55.96,14.47 55.5,14.93 52.88,14.93 v1(52.83,14.98) ; CN4.3 53.2,10.56 v1(52.58,11.18)
  Bottom Layer w0.254: v1(52.58,11.18) 52.83,11.44 v1(52.83,14.98)
GPIO38: length 32
  Top Layer w0.254: 51.69,11.17 50.33,9.81 49.69,9.81 49.2,9.31 CN4.1 ; v1(52.25,13.63) 52.83,14.22 54.2,14.22 54.56,14.57 55.04,14.57 55.5,14.12 66.77,14.12 67.28,14.62 70.02,14.62 72.76,17.36 U1.31
  Bottom Layer w0.254: v1(51.69,11.31) 52.25,11.87 v1(52.25,13.63)
GPIO39: length 35.9
  Top Layer w0.254: v1(54.8,13.99) 55.03,13.76 66.92,13.76 67.43,14.27 70.17,14.27 72.61,16.71 73.61,16.71 74.03,17.13 U1.32 ; v1(54.48,11.21) 58.24,7.45 61.95,7.45 62.78,6.62 CN5.3
  Bottom Layer w0.254: v1(54.48,11.21) 54.8,11.53 v1(54.8,13.99)
GPIO40: length 35.4
  Top Layer w0.254: v1(53.47,13.63) 53.69,13.41 67.07,13.41 67.58,13.91 70.32,13.91 72.76,16.35 74.91,16.35 75.3,16.75 U1.33 ; CN5.1 58.15,6.62 v1(53.47,11.3)
  Bottom Layer w0.254: v1(53.47,13.63) v1(53.47,11.3)
GPIO41: length 19.4
  Top Layer w0.254: U1.34 76.58,18.43 v1(76.58,20.31) ; CN7.3 74.73,7.24 74.73,13.79 74.45,14.06 v1(73.55,14.06)
  Bottom Layer w0.254: v1(73.55,14.06) 73.55,19.31 74.55,20.31 v1(76.58,20.31)
GPIO42: length 19.9
  Top Layer w0.254: CN7.1 70.07,11.55 73.17,14.65 v1(74.54,14.65) ; v1(77.72,19.68) 77.72,18.53 U1.35
  Bottom Layer w0.254: v1(74.54,14.65) 74.54,19.05 75.18,19.68 v1(77.72,19.68)
GPIO45: length 41.5
  Top Layer w0.254: v1(54.23,24.5) 54.25,24.49 60.98,24.49 65.28,20.18 U1.26
  Bottom Layer w0.254: H3.3 34.23,29.27 33.6,28.64 33.6,25.31 35.63,23.28 49.46,23.28 50.96,24.78 53.95,24.78 v1(54.23,24.5)
GPIO46: length 46.8
  Top Layer w0.254: v1(54.61,34.54) 58.6,34.54 59.72,33.42 65.86,33.42 U1.16 ; v1(38.61,37.33) U7.3
  Bottom Layer w0.254: v1(54.61,34.54) 54.84,34.77 54.84,44.42 54.36,44.9 40.46,44.9 40.06,44.5 40.06,40.48 39.34,39.77 38.89,39.77 38.61,39.49 v1(38.61,37.33)
GPIO48: length 37.6
  Top Layer w0.254: U1.25 64.52,21.45 61.12,24.84 55.03,24.84 v1(54.74,25.14)
  Bottom Layer w0.254: H3.4 34.35,26.73 34.04,26.41 34.04,25.39 35.79,23.64 49.17,23.64 50.67,25.14 v1(54.74,25.14)
GPIORST: length 103.8
  Top Layer w0.254: C38.2 79.18,9.23 R8.1 77.46,9.26 75.69,9.26 75.08,9.87 75.08,13.78 76.18,14.88 78.13,14.88 78.48,15.23 v1(78.99,15.23) ; C38.2 80.5,9.24 SW2.1 ; C38.2 79.19,9.57 78.36,10.41 78.36,11.44 78.76,11.84 79.62,11.84 79.65,11.81 83.57,11.81 83.82,11.55 83.82,10.53 SW2.1 ; v1(78.87,19.93) 81.65,22.72 U1.3 ; v1(77.85,16.63) 77.22,16 72.9,16 69.6,12.69 25.31,12.69 25.31,12.72 24.98,13.05 Q4.3
  Bottom Layer w0.254: v1(78.99,15.23) 77.85,16.38 v1(77.85,16.63) 78.87,17.65 v1(78.87,19.93)
GPIORX0: length 70.6
  Top Layer w0.254: U1.36 79.12,18.4 79.12,16.95 77.81,15.64 73.05,15.64 69.74,12.32 22.97,12.32 22.73,12.57 22.15,12.57 21.91,12.32 19.26,12.32 18.91,12.68 18.91,14.6 18.77,14.74 15.38,14.74 15.1,14.46 U26.8
GPIOTX0: length 70.8
  Top Layer w0.254: U1.37 80.38,17.64 77.98,15.23 73.22,15.23 69.9,11.92 16.79,11.92 16.27,12.44 14.35,12.44 14.1,12.69 U26.9
MP_BST: length 3.2
  Top Layer w0.254: C24.1 16.94,26.22 15.56,27.61 U13.5
MP_EN/SYNC: length 4.5
  Top Layer w0.254: U13.6 14.8,28.62 14.22,29.2 14.22,31.12 R7.1
MP_FB: length 7.6
  Top Layer w0.254: R9.1 19.33,33.57 17.82,32.06 17.82,29.6 C21.1 17.42,29.92 U13.8
MP_SW: length 14.3
  Top Layer w0.254: C24.2 17.34,24.82 16.3,25.86 12.31,25.86 12.03,25.58
  Top Layer w0.508: 9.06,23.62 10.42,23.62 12.03,25.23 12.03,28.46 12.19,28.62 U13.3
RTS: length 8.3
  Top Layer w0.254: Q4.2 22.99,13.26 22.99,14.22 22.73,14.47 21.97,14.47 R16.1 21.21,15.23 20.32,15.23 19.89,14.8 v1(19.89,14.22) ; U26.6 17.61,14.22 18.3,14.22 18.36,14.16
  Bottom Layer w0.254: v1(19.89,14.22) 19.83,14.16 18.36,14.16
  vias: v1(18.32,14.16)
USB_D+: length 5.3
  Top Layer w0.254: R36.1 9.81,10.42 U15.B6 6.72,10.42 6.48,10.66 6.48,11.17 6.73,11.42 U15.A6
USB_D-: length 4.1
  Top Layer w0.254: 8.38,11.63 8.38,11.17 8.13,10.92 7.48,10.92 U15.A7 ; 8.38,11.63 8.09,11.92 U15.B7 ; 8.38,11.63 9.91,11.63 R37.1
VM: length 127.4
  Top Layer w0.254: R5.2 59.94,35.94 v1(42.8,35.94) ; C20.2 C19.2 11.42,29.27 U13.2 ; 11.18,33.27 13.46,33.27 R7.2
  Top Layer w0.508: C4.2 49.08,42.39 48.4,42.39 48.04,42.03 48.04,38.7 47.37,38.03 41.47,38.03 40.89,38.6 40.89,43.34 U7.5 43.26,44.35 C7.1 ; C5.1 17.32,44.35 U3.5 14.99,43.46 14.99,38.73 15.49,38.22 21.21,38.22 21.72,38.73 21.72,41.9 22.54,42.73 C8.2 ; 31.88,35.93 v1(15.07,35.93) 11.68,35.93 11.18,35.43 C19.2
  Bottom Layer w0.508: C5.1 15.63,42.92 14.99,42.28 14.99,37.71 15.07,37.63 v1(15.07,35.93) ; v1(31.94,35.93) 42.67,35.93 43.05,36.31 43.05,42.41 43.57,42.92 C7.1
$1N47: length 2.1
  Top Layer w0.254: R1.2 60.17,38.05
$1N57: length 4
  Top Layer w0.254: 40.78,20.18 40.78,19.81 40.7,19.73 40.7,19.73 40.53,19.57 40.53,19.44 v1(40.39,19.3) ; v1(41.33,21.41) 41.74,21.41 R4.1
  Bottom Layer w0.254: v1(40.39,19.3) 41.02,19.93 41.02,21.09 v1(41.33,21.41)
$1N85: length 49.1
  Top Layer w0.508: 10.29,44.35 10.29,48.15 U4.6 11.86,50.28 20.07,50.28 21.21,49.14 21.21,47.64 21.72,47.13 23.38,47.13 23.86,47.62 23.86,50.4 24.68,51.21 45.68,51.21 46.2,50.69 CN2.2
$1N86: length 57.3
  Top Layer w0.508: U3.6 12.83,43.68 12.45,43.3 9.86,43.3 9.35,43.81 9.35,47.41 8.76,48 8.76,48.82 10.84,50.89 20.71,50.89 ; 20.71,50.89 22.51,49.1 U4.1 ; 20.71,50.89 23.5,50.89 24.43,51.82 48.23,51.82 48.74,51.32 CN2.1
$1N109: length 58.6
  Top Layer w0.508: 38.92,50.6 28.68,50.6 26.79,48.72 26.79,48 27.18,47.62 27.18,44.82 28.7,43.3 38.48,43.3 38.61,43.43 U7.6 ; 38.92,50.6 44.39,50.6 44.83,50.16 44.83,47.49 45.19,47.13 50.29,47.13 50.65,47.49 50.65,50.1 51.16,50.6 56.26,50.6 56.77,50.1 CN3.1 ; 38.92,50.6 40.64,48.88 U5.1
$1N111: length 45.3
  Top Layer w0.508: U7.8 28.79,44.35 28.14,45 U5.6 28.14,48.96 29.17,49.99 38.66,49.99 39.47,49.19 39.47,47.51 40.46,46.52 50.54,46.52 51.26,47.24 51.26,49.73 51.52,49.99 53.89,49.99 54.23,49.65 CN3.2
$1N360: length 4.5
  Top Layer w0.254: U13.7 14.79,29.27 14.61,29.46 14.61,31.74 14.92,32.06 C18.1
$1N369: length 1.7
  Top Layer w0.254: LED5.2 63.87,38.16 R23.1
$2N49: length 2.9
  Top Layer w0.254: R16.2 21.96,16.96 22.76,16.96 23.02,17.21 Q5.1
$2N51: length 3.7
  Top Layer w0.254: Q4.1 26.38,15.16 R17.2
$2N56: length 4.6
  Top Layer w0.254: 14.1,8.21 14.1,8.94 R37.2
$2N57: length 4.4
  Top Layer w0.254: R36.2 12.55,9.08 12.55,7.74 12.78,7.51 13.1,7.51 13.1,8.21
$2N60: length 2.7
  Top Layer w0.254: U15.B5 9.37,9.42 R35.2
$2N64: length 2.7
  Top Layer w0.254: U15.A5 9.36,12.42 9.95,13.02

## Copper pours and planes (outline as drawn; the poured copper is in the pictures)
GND on Top Layer: 74.42,30.73 78.61,30.73 78.61,26.28 74.42,26.28
GND on Top Layer: 0,56 85.85,56 85.85,-0.13 0,-0.13
GND on Bottom Layer: 0,56 85.85,56 85.85,-0.13 0,-0.13
VM on Top Layer: 1.91,29.9 13.84,29.9 13.84,27.3 1.91,27.3
$1N348 on Top Layer: 0.64,34.28 8.25,34.28 8.25,17.01 0.64,17.01

## Text on the board
Top Silkscreen Layer: G | OUT1 | IO18 | IO17 | 3.3V | OUT2 | IO45 | IO48 | IO35 | IO36 | IO11 | IO10 | 5V | IO21 | ECHO | IO12 | IO13 | IO38 | IO37 | IO40 | IO39 | IO7 | IO6 | IO42 | IO5 | IO4 | IO41 | RST | IO0 | 舵机
